# Altium schematic sheet Top_Sheet.SchDoc
size A; SheetNumber: 1; SheetTotal: 3
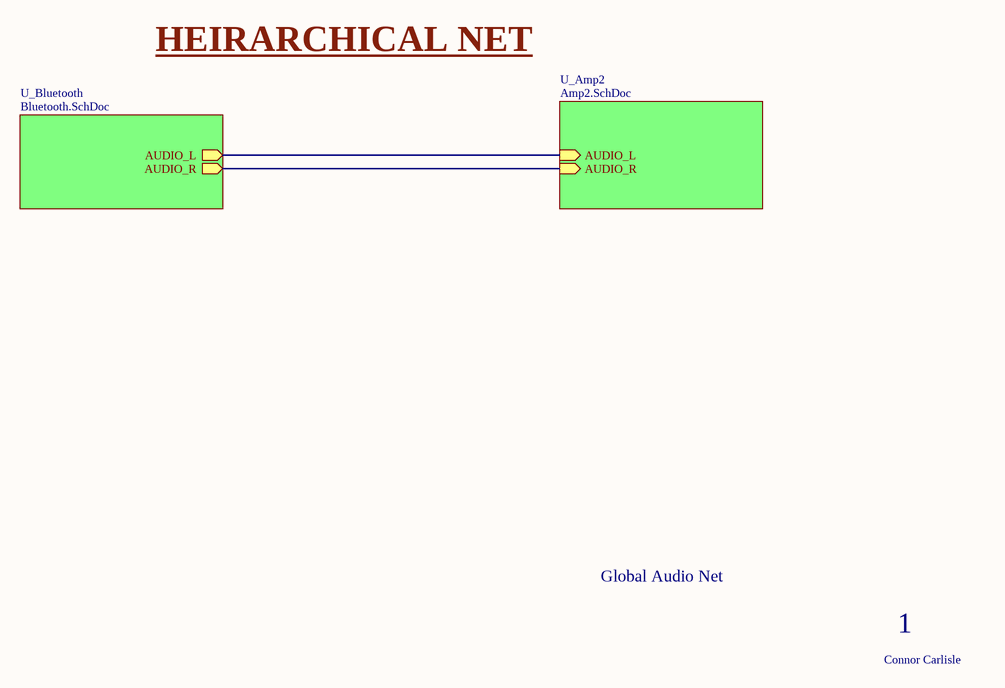
[diagram p0: Top_Sheet.SchDoc]

## Sub-sheets
U_Amp2 = Amp2.SchDoc: AUDIO_L (in), AUDIO_R (in)
U_Bluetooth = Bluetooth.SchDoc: AUDIO_L (out), AUDIO_R (out)

## Nets
(unnamed): sheet U_Amp2/AUDIO_L, sheet U_Bluetooth/AUDIO_L
(unnamed): sheet U_Amp2/AUDIO_R, sheet U_Bluetooth/AUDIO_R

## Notes on the sheet
- HEIRARCHICAL NET
- Global Audio Net
- 1
- Connor Carlisle